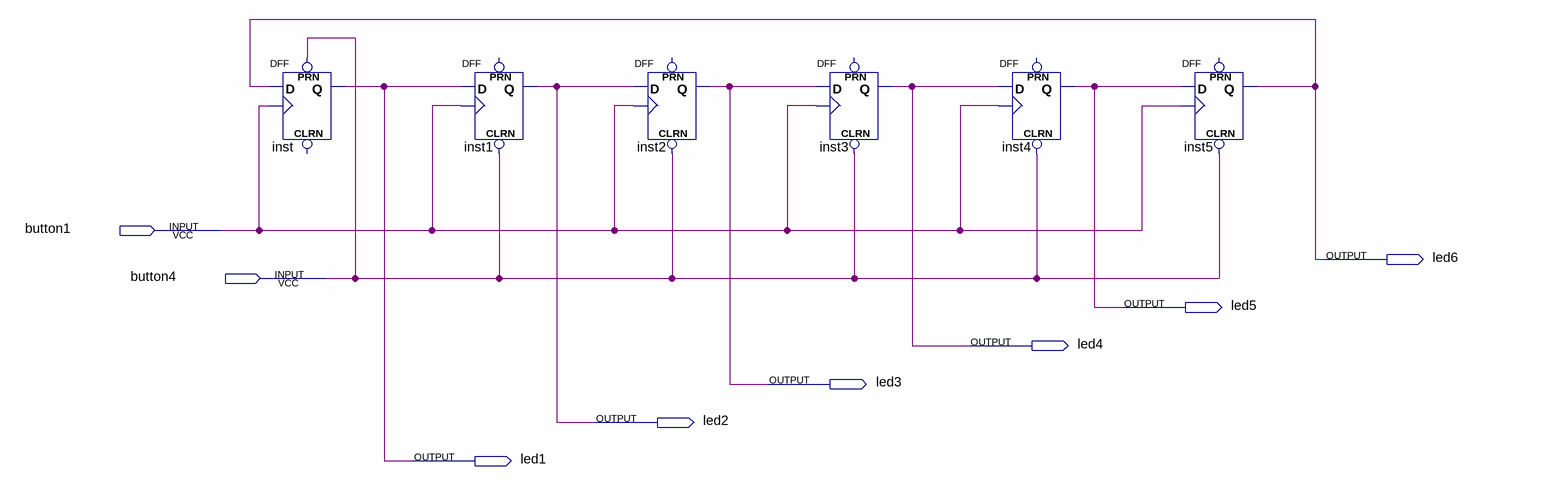
[diagram p0: schematic sheet]
// Quartus schematic Ring_counter_6bit.bdf as structural Verilog: 6 symbols, 8 pins
module Ring_counter_6bit (
  input  button1,
  input  button4,
  output led6,
  output led5,
  output led4,
  output led3,
  output led2,
  output led1
);

  DFF inst (.CLK(button1), .D(led6), .PRN(button4), .Q(led1));  // open: CLRN
  DFF inst1 (.CLRN(button4), .CLK(button1), .D(led1), .Q(led2));  // open: PRN
  DFF inst2 (.CLRN(button4), .CLK(button1), .D(led2), .Q(led3));  // open: PRN
  DFF inst3 (.CLRN(button4), .CLK(button1), .D(led3), .Q(led4));  // open: PRN
  DFF inst4 (.CLRN(button4), .CLK(button1), .D(led4), .Q(led5));  // open: PRN
  DFF inst5 (.CLRN(button4), .CLK(button1), .D(led5), .Q(led6));  // open: PRN
endmodule
